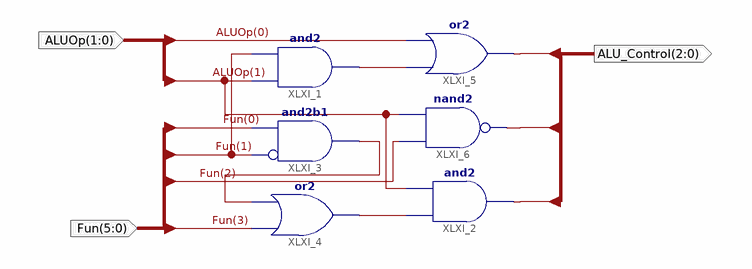
[diagram p0: schematic sheet 1]
// Xilinx ISE schematic ALU_Decoder.sch (kintex7) as structural Verilog: 6 symbols, 3 ports
module ALU_Decoder (
  input  [5:0] Fun,
  input  [1:0] ALUOp,
  output [2:0] ALU_Control
);

  wire XLXN_1, XLXN_2, XLXN_5;

  and XLXI_1 (XLXN_1, ALUOp[1], Fun[1]);
  and XLXI_2 (ALU_Control[0], XLXN_2, ALUOp[1]);
  and XLXI_3 (XLXN_5, ~Fun[1], Fun[0]);  // and2b1
  or XLXI_4 (XLXN_2, Fun[3], XLXN_5);
  or XLXI_5 (ALU_Control[2], XLXN_1, ALUOp[0]);
  nand XLXI_6 (ALU_Control[1], Fun[2], ALUOp[1]);
endmodule
